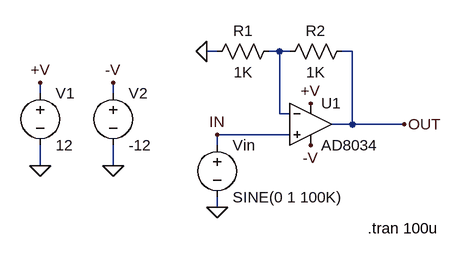
[diagram p0: schematic AD8033.asc]
AD8033.asc, the LTspice schematic file:
Version 4
SHEET 1 1240 700
WIRE 432 -1216 416 -1216
WIRE 528 -1216 512 -1216
WIRE 544 -1216 528 -1216
WIRE 640 -1216 624 -1216
WIRE 160 -1152 160 -1168
WIRE 272 -1152 272 -1168
WIRE 528 -1120 528 -1216
WIRE 544 -1120 528 -1120
WIRE 640 -1104 640 -1216
WIRE 640 -1104 608 -1104
WIRE 720 -1104 640 -1104
WIRE 544 -1088 432 -1088
WIRE 432 -1072 432 -1088
WIRE 160 -1040 160 -1072
WIRE 272 -1040 272 -1072
WIRE 432 -976 432 -992
FLAG 160 -1168 +V
FLAG 432 -976 0
FLAG 720 -1104 OUT
FLAG 432 -1088 IN
FLAG 576 -1136 +V
FLAG 272 -1168 -V
FLAG 576 -1072 -V
FLAG 416 -1216 0
FLAG 272 -1040 0
FLAG 160 -1040 0
SYMBOL voltage 160 -1168 R0
WINDOW 123 0 0 Left 2
WINDOW 39 0 0 Left 2
SYMATTR InstName V1
SYMATTR Value 12
SYMBOL voltage 432 -1088 R0
WINDOW 123 24 146 Left 2
WINDOW 39 24 125 Left 2
SYMATTR InstName Vin
SYMATTR Value SINE(0 1 100K)
SYMBOL res 528 -1232 R90
WINDOW 0 0 56 VBottom 2
WINDOW 3 32 56 VTop 2
SYMATTR InstName R1
SYMATTR Value 1K
SYMBOL res 640 -1232 R90
WINDOW 0 0 56 VBottom 2
WINDOW 3 32 56 VTop 2
SYMATTR InstName R2
SYMATTR Value 1K
SYMBOL Opamps\\AD8034 576 -1168 R0
SYMATTR InstName U1
SYMBOL voltage 272 -1168 R0
WINDOW 123 24 146 Left 2
WINDOW 39 24 125 Left 2
SYMATTR InstName V2
SYMATTR Value -12
TEXT 664 -944 Left 2 !.tran 100u

The netlist it stands for:
* AD8033.asc
V1 +V 0 12
Vin IN 0 SINE(0 1 100K)
R1 N001 0 1K
R2 OUT N001 1K
XU1 IN N001 +V -V OUT AD8034  ; pins In+ In- V+ V- OUT
V2 -V 0 -12
.tran 100u
.backanno
.end